# Altium project Pinto.PrjPcb
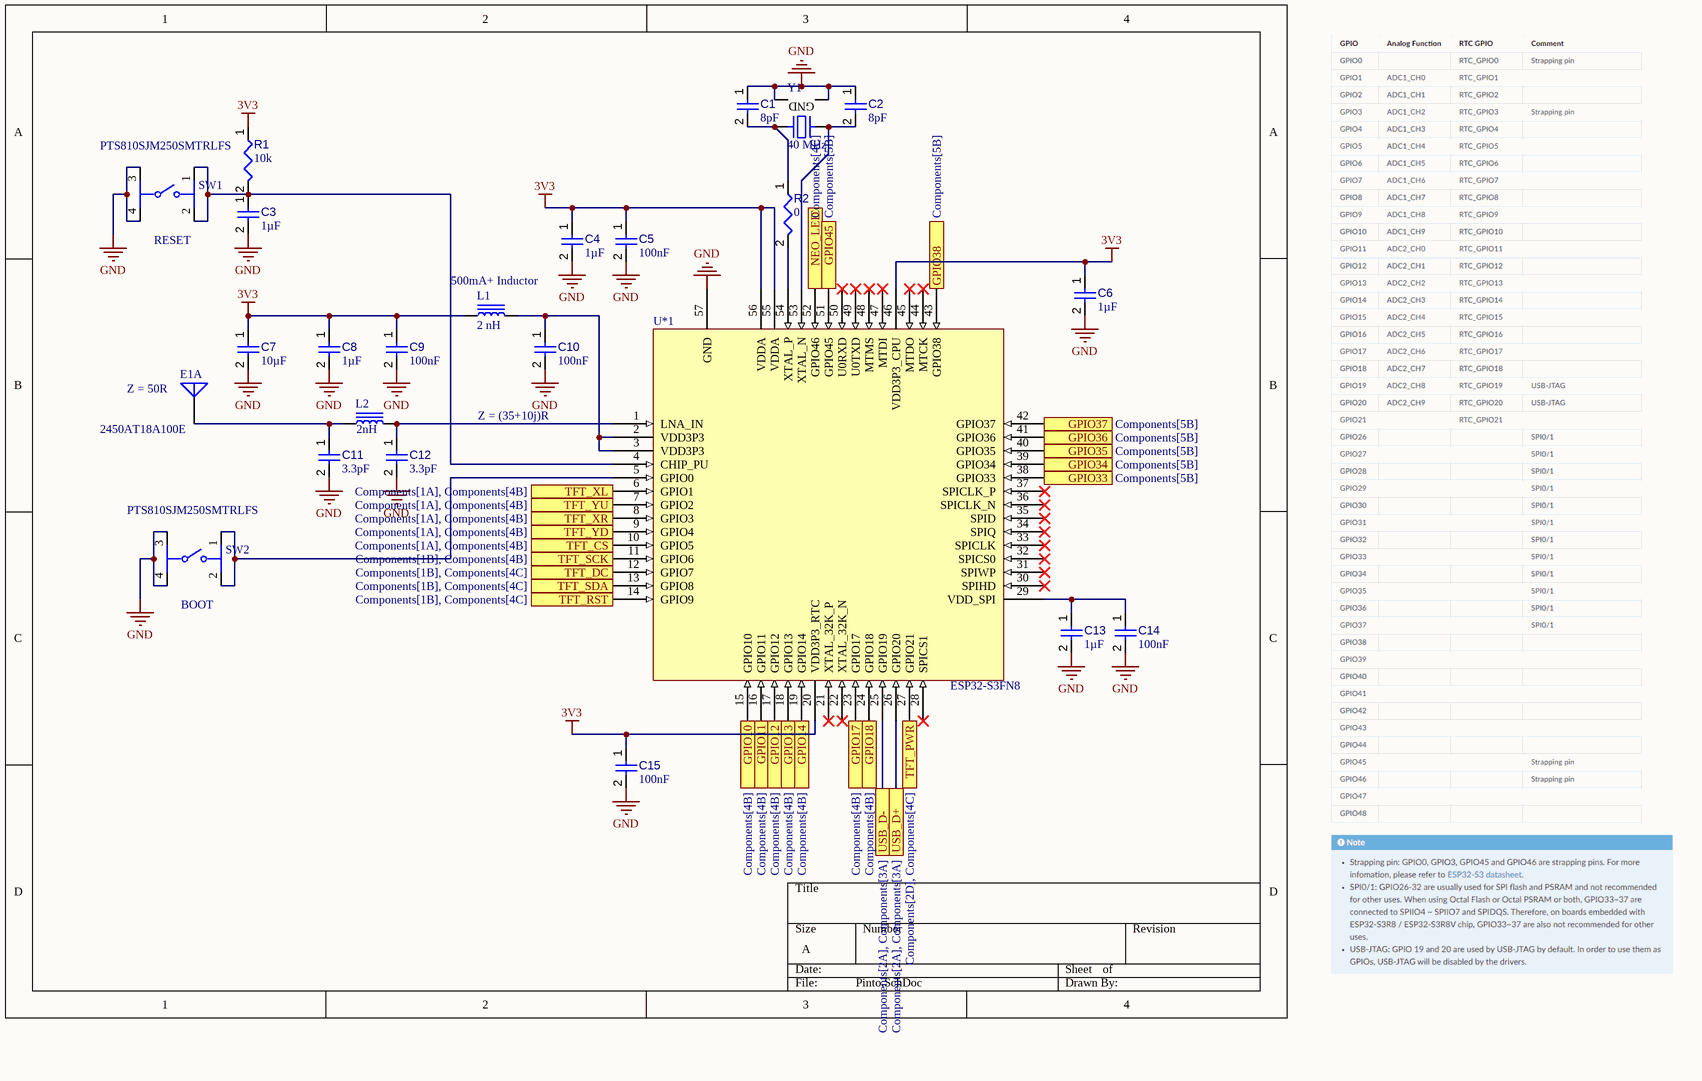
[diagram p0: Pinto.SchDoc]
2 sheets, 41 parts. Net scope: flat (ports and power ports of the same name join across sheets).
Board file: PCB.PcbDoc
Sheets:
  Pinto.SchDoc
  Components.SchDoc

## Sheet Pinto.SchDoc
size A; SheetNumber: 1; SheetTotal: 2

### Parts
C1  value 8pF  [CAPC0402(1005)33_L]  (hidden comment: Capacitor 12pF +/-10% 50V 0402)
C2  value 8pF  [CAPC0402(1005)33_L]  (hidden comment: Capacitor 12pF +/-10% 50V 0402)
C3  value 1µF  [CAPC0402(1005)60_L]  (hidden comment: Capacitor 1µF +/-20% 10V 0402)
C4  value 1µF  [CAPC0402(1005)60_L]  (hidden comment: Capacitor 1µF +/-20% 10V 0402)
C5  value 100nF  [CAPC0402(1005)60_L]  (hidden comment: Capacitor 100nF +/-20% 10V 0402)
C6  value 1µF  [CAPC0402(1005)60_L]  (hidden comment: Capacitor 1µF +/-20% 10V 0402)
C7  value 10µF  [CAPC0402(1005)60_L]  (hidden comment: Capacitor 10µF +/-40% 6.3V 0402)
C8  value 1µF  [CAPC0402(1005)60_L]  (hidden comment: Capacitor 1µF +/-20% 10V 0402)
C9  value 100nF  [CAPC0402(1005)60_L]  (hidden comment: Capacitor 100nF +/-20% 10V 0402)
C10  value 100nF  [CAPC0402(1005)60_L]  (hidden comment: Capacitor 100nF +/-20% 10V 0402)
C11  value 3.3pF  [CAPC1005X56X25LL10T15]  (hidden comment: Capacitor 0.1 uF +/- 5% 16 V 0402)
C12  value 3.3pF  [CAPC1005X56X25LL10T15]  (hidden comment: Capacitor 0.1 uF +/- 5% 16 V 0402)
C13  value 1µF  [CAPC0402(1005)60_L]  (hidden comment: Capacitor 1µF +/-20% 10V 0402)
C14  value 100nF  [CAPC0402(1005)60_L]  (hidden comment: Capacitor 100nF +/-20% 10V 0402)
C15  value 100nF  [CAPC0402(1005)60_L]  (hidden comment: Capacitor 100nF +/-20% 10V 0402)
E1  2450AT18A100E  [JT-2450AT18A100-2_V]  (part A of 2)
L1  2 nH  [IND 0201_0603]
L2  2nH  [IND 0201_0603]
R1  value 10k  [RESC0402(1005)_L]  (hidden comment: 10KR2F)
R2  value 0  [RESC0402(1005)_L]  (hidden comment: 0R2J)
SW1  PTS810SJM250SMTRLFS  [FP-PTS810SJM250SMTRLFS-MFG]
SW2  PTS810SJM250SMTRLFS  [FP-PTS810SJM250SMTRLFS-MFG]
U*1  ESP32-S3FN8  [PCBComponent_1]
Y1  40 MHz  [NDK NX3225SA]

### Ports
GPIO10 (see Components[4B]), GPIO11 (see Components[4B]), GPIO12 (see Components[4B]), GPIO13 (see Components[4B]), GPIO14 (see Components[4B]), GPIO17 (see Components[4B]), GPIO18 (see Components[4B]), GPIO33 (see Components[5B]), GPIO34 (see Components[5B]), GPIO35 (see Components[5B]), GPIO36 (see Components[5B]), GPIO37 (see Components[5B]), GPIO38 (see Components[5B]), GPIO45 (see Components[5B]), NEO_LED (see Components[4C]), TFT_CS (see Components[1A], Components[4B]), TFT_DC (see Components[1B], Components[4C]), TFT_PWR (see Components[2D], Components[4C]), TFT_RST (see Components[1B], Components[4C]), TFT_SCK (see Components[1B], Components[4B]), TFT_SDA (see Components[1B], Components[4C]), TFT_XL (see Components[1A], Components[4B]), TFT_XR (see Components[1A], Components[4B]), TFT_YD (see Components[1A], Components[4B]), TFT_YU (see Components[1A], Components[4B]), USB_D+ (see Components[2A], Components[3A]), USB_D- (see Components[2A], Components[3A])

### Nets
3V3: C4.1 C5.1 C6.1 C7.1 C8.1 C9.1 C15.1 L1.1 R1.1 U*1.20(VDD3P3_RTC) U*1.46(VDD3P3_CPU) U*1.55(VDDA) U*1.56(VDDA)
GND: C1.1 C2.1 C3.2 C4.2 C5.2 C6.2 C7.2 C8.2 C9.2 C10.2 C11.2 C12.2 C13.2 C14.2 C15.2 SW1.3 SW1.4 SW2.3 SW2.4 U*1.57(GND) Y1.2(GND) Y1.4(GND)
NetC1_2: C1.2 R2.1 Y1.3
NetC2_2: C2.2 U*1.53(XTAL_N) Y1.1
NetC3_1: C3.1 R1.2 SW1.1 SW1.2 U*1.4(CHIP_PU)
NetC10_1: C10.1 L1.2 U*1.2(VDD3P3) U*1.3(VDD3P3)
NetC11_1: C11.1 E1.1(FP) L2.1
NetC12_1: C12.1 L2.2 U*1.1(LNA_IN)
NetC13_1: C13.1 C14.1 U*1.29(VDD_SPI)
NetJ1_1: U*1.6(GPIO1) ; port TFT_XL
NetJ1_2: U*1.7(GPIO2) ; port TFT_YU
NetJ1_3: U*1.8(GPIO3) ; port TFT_XR
NetJ1_4: U*1.9(GPIO4) ; port TFT_YD
NetJ1_9: U*1.10(GPIO5) ; port TFT_CS
NetJ1_10: U*1.11(GPIO6) ; port TFT_SCK
NetJ1_11: U*1.12(GPIO7) ; port TFT_DC
NetJ1_13: U*1.13(GPIO8) ; port TFT_SDA
NetJ1_15: U*1.14(GPIO9) ; port TFT_RST
NetJ2_A6: U*1.26(GPIO20) ; port USB_D+
NetJ2_A7: U*1.25(GPIO19) ; port USB_D-
NetP1_3: U*1.15(GPIO10) ; port GPIO10
NetP1_4: U*1.16(GPIO11) ; port GPIO11
NetP1_5: U*1.17(GPIO12) ; port GPIO12
NetP1_6: U*1.18(GPIO13) ; port GPIO13
NetP1_7: U*1.19(GPIO14) ; port GPIO14
NetP1_8: U*1.23(GPIO17) ; port GPIO17
NetP1_9: U*1.24(GPIO18) ; port GPIO18
NetP2_3: U*1.51(GPIO45) ; port GPIO45
NetP2_4: U*1.43(GPIO38) ; port GPIO38
NetP2_5: U*1.42(GPIO37) ; port GPIO37
NetP2_6: U*1.41(GPIO36) ; port GPIO36
NetP2_7: U*1.40(GPIO35) ; port GPIO35
NetP2_8: U*1.39(GPIO34) ; port GPIO34
NetP2_9: U*1.38(GPIO33) ; port GPIO33
NetP3_10: U*1.27(GPIO21) ; port TFT_PWR
NetR2_2: R2.2 U*1.54(XTAL_P)
NetSW2_1: SW2.1 SW2.2 U*1.5(GPIO0)
NetU2_4: U*1.52(GPIO46) ; port NEO_LED

Not connected (* = marked no-connect by the designer): U*1 21(XTAL_32K_P)* 22(XTAL_32K_N)* 28(SPICS1)* 30(SPIHD)* 31(SPIWP)* 32(SPICS0)* 33(SPICLK)* 34(SPIQ)* 35(SPID)* 36(SPICLK_N)* 37(SPICLK_P)* 44(MTCK)* 45(MTDO)* 47(MTDI)* 48(MTMS)* 49(U0TXD)* 50(U0RXD)*

### Notes on the sheet
- (near SW1) RESET
- 500mA+ Inductor
- (near E1) Z = 50R
- Z = (35+10j)R
- (near SW2) BOOT

### Library data of the parts
C1 C2 = CMP-001-00072-4: Chip Capacitor, 12pF +/-10%, 50V, 0402, Thickness 0.33 mm; Tolerance: 20%; Pins: 2; Max Operating Temperature: 85°C; Case/Package: 0402; Voltage Rating: 50V; Mounting Technology: SMT; Min Operating Temperature: -55°C
C3 C4 C6 C8 C13 = CMP-001-00063-3: Chip Capacitor, 1µF +/-20%, 10V, 0402, Thickness 0.6 mm; Tolerance: 10%; Mounting Technology: SMT; Max Operating Temperature: 85°C; Voltage Rating: 10V; Pins: 2; Case/Package: 0402; Min Operating Temperature: -55°C
C5 C9 C10 C14 C15 = CMP-001-00061-3: Chip Capacitor, 100nF +/-20%, 10V, 0402, Thickness 0.6 mm; Tolerance: 20%; Mounting Technology: SMT; Voltage Rating: 10V; Max Operating Temperature: 85°C; Pins: 2; Case/Package: 0402; Min Operating Temperature: -55°C
C7 = CMP-001-00074-3: Chip Capacitor, 10µF +/-40%, 6.3V, 0402, Thickness 0.6 mm; Tolerance: 10%; Case/Package: 0402; Pins: 2; Mounting Technology: SMT; Voltage Rating: 6.3V; Max Operating Temperature: 85°C; Min Operating Temperature: -55°C
C11 C12 = CMP-001-00001-6: Chip Capacitor, 0.1 uF, +/- 5%, 16 V, 0402 (1005 Metric); Capacitor Type: Ceramic; Voltage Rating: 16V; Max Operating Temperature: 125°C; Min Operating Temperature: -55°C; Case/Package: 0402; Mounting Technology: SM; Pins: 2; Tolerance: 5%; RoHS Compliant: True
E1 = CMP-2000-05167-1: Ceramic Antenna, 2.45 GHZ, 2 W, -40 to 125 degC, 2-Pin SMD, RoHS, Tape and Reel; Manufacturer: Johanson Technology; Maximum Frequency: 2500MHz; Typical Antenna Gain: 0.5dB; Minimum Frequency: 2400MHz; Manufacturer URL: https://www.johansontechnology.com/; Type: Ceramic; Datasheet Version: Rev. 1.3, 07/2014; Category: Antenna; Package: 2Case18-4; Datasheet URL: http://www.johansontechnology.com/datasheets/antennas/2450AT18A100.pdf
L1 L2 = WLCM0603TGB2N0TB: INDUCTOR FIXED 2.0NH 0201; Manufacturer: Walsin Technology Corporation; Current Rating (Amps): 450 mA; DC Resistance (DCR): 200mOhm Max; Frequency - Self Resonant: 12.5GHz; Inductance Frequency - Test: 500 MHz; Material - Core: Ceramic; Q @ Freq: 12 @ 500MHz; Shielding: Unshielded; Tolerance: ±0.1nH; Type: Multilayer; Part Number: WLCM0603TGB2N0TB; ComponentLink1Description: Datasheet; ComponentLink1URL: https://www.passivecomponent.com/wp-content/uploads/inductor/WLCM0603TG_Series.pdf; ComponentLink2Description: DigiKey Link; ComponentLink2URL: https://www.digikey.com/en/products/detail/walsin-technology-corporation/WLCM0603TGB2N0TB/14563834; Device Package: 0201 (0603 Metric); Height - Seated (Max): 0.013" (0.33mm); Inductance: 2 nH; LastUpdated: 1/2/2023 9:01:21 PM; Lifecycle Status: Active; Minimum Order: 1; Mounting Type: Surface Mount; Operating Temperature: -55°C ~ 125°C; Package / Case: 0201 (0603 Metric); Packaging: CutTape; PartId: 3830; Part Status: Active; Price: 0.01; Series: CM; Size / Dimension: 0.024" L x 0.012" W (0.60mm x 0.30mm); Supplier 1: DigiKey; Supplier Part Number 1: 1292-WLCM0603TGB2N0TBCT-ND; Supplier Device Package: 0201; Value: 2 nH
R1 = CMP-009-00066-2: 10K 0.063W 1% 0402 (1005 Metric)  SMD; Power: 63mW; Case/Package: 0402; Mounting Technology: SMT; Pins: 2; Tolerance: 1%
R2 = CMP-009-00062-2: Jumper 0402 (1005 Metric); Pins: 2; Mounting Technology: SMT; Case/Package: 0402
SW1 SW2 = CMP-10040-000001-2: SWITCH TACTILE SPST-NO 0.05A 16V; Throw Configuration: SPST; Operating Force: 160gf; Actuator Type: Standard; Switch Travel: 0.15mm; Switch Function: Off-Mom; Max Current Rating: 50mA; Mechanical Life: 150000Cycles; Illumination Type: Non-Illuminated; Package Quantity: 2900; Depth: 4.6mm; Mount: Surface Mount; Packaging: Tape and Reel; Length: 3.2mm; RoHS Compliant: Yes; Case/Package: SMD/SMT; Voltage Rating (DC): 16V; Min Operating Temperature: -40°C; Termination: J-Bend; Lead Free: Lead Free; Contact Plating: Silver; Orientation: Straight; Max Operating Temperature: 85°C; Current Rating: 50mA; Color: Black
U*1 = ESP32-S3FN8: ESP32 MCU
Y1 = NX3225SA-40M-EXS00A-CS03880: CRYSTAL 40.0000MHZ 10PF SMD; Manufacturer: NDK America, Inc.; ESR (Equivalent Series Resistance): 50 Ohms; Frequency Stability: ±17ppm; Frequency Tolerance: ±10ppm; Operating Mode: Fundamental; Part Number: NX3225SA-40M-EXS00A-CS03880; ComponentLink1Description: Datasheet; ComponentLink1URL: //media.digikey.com/pdf/Data%20Sheets/NDK%20PDFs/NX3225SA-40M-EXS00A-CS03880.pdf; ComponentLink2Description: DigiKey Link; ComponentLink2URL: https://www.digikey.com/en/products/detail/ndk-america-inc/NX3225SA-40M-EXS00A-CS03880/5015625; Frequency: 40 MHz; Height - Seated (Max): 0.024" (0.60mm); LastUpdated: 1/2/2023 8:58:25 PM; Lifecycle Status: Active; Load Capacitance: 10pF; Minimum Order: 1; Mounting Type: Surface Mount; Operating Temperature: -40°C ~ 85°C; Package / Case: 4-SMD, No Lead; Packaging: TapeAndReel; PartId: 586; Part Status: Active; Price: 0.36; Series: NX3225SA; Size / Dimension: 0.126" L x 0.098" W (3.20mm x 2.50mm); Supplier 1: DigiKey; Supplier Part Number 1: 644-1249-1-ND; Type: MHz Crystal; Value: 40 MHz

## Sheet Components.SchDoc
size B; SheetNumber: 2; SheetTotal: 2
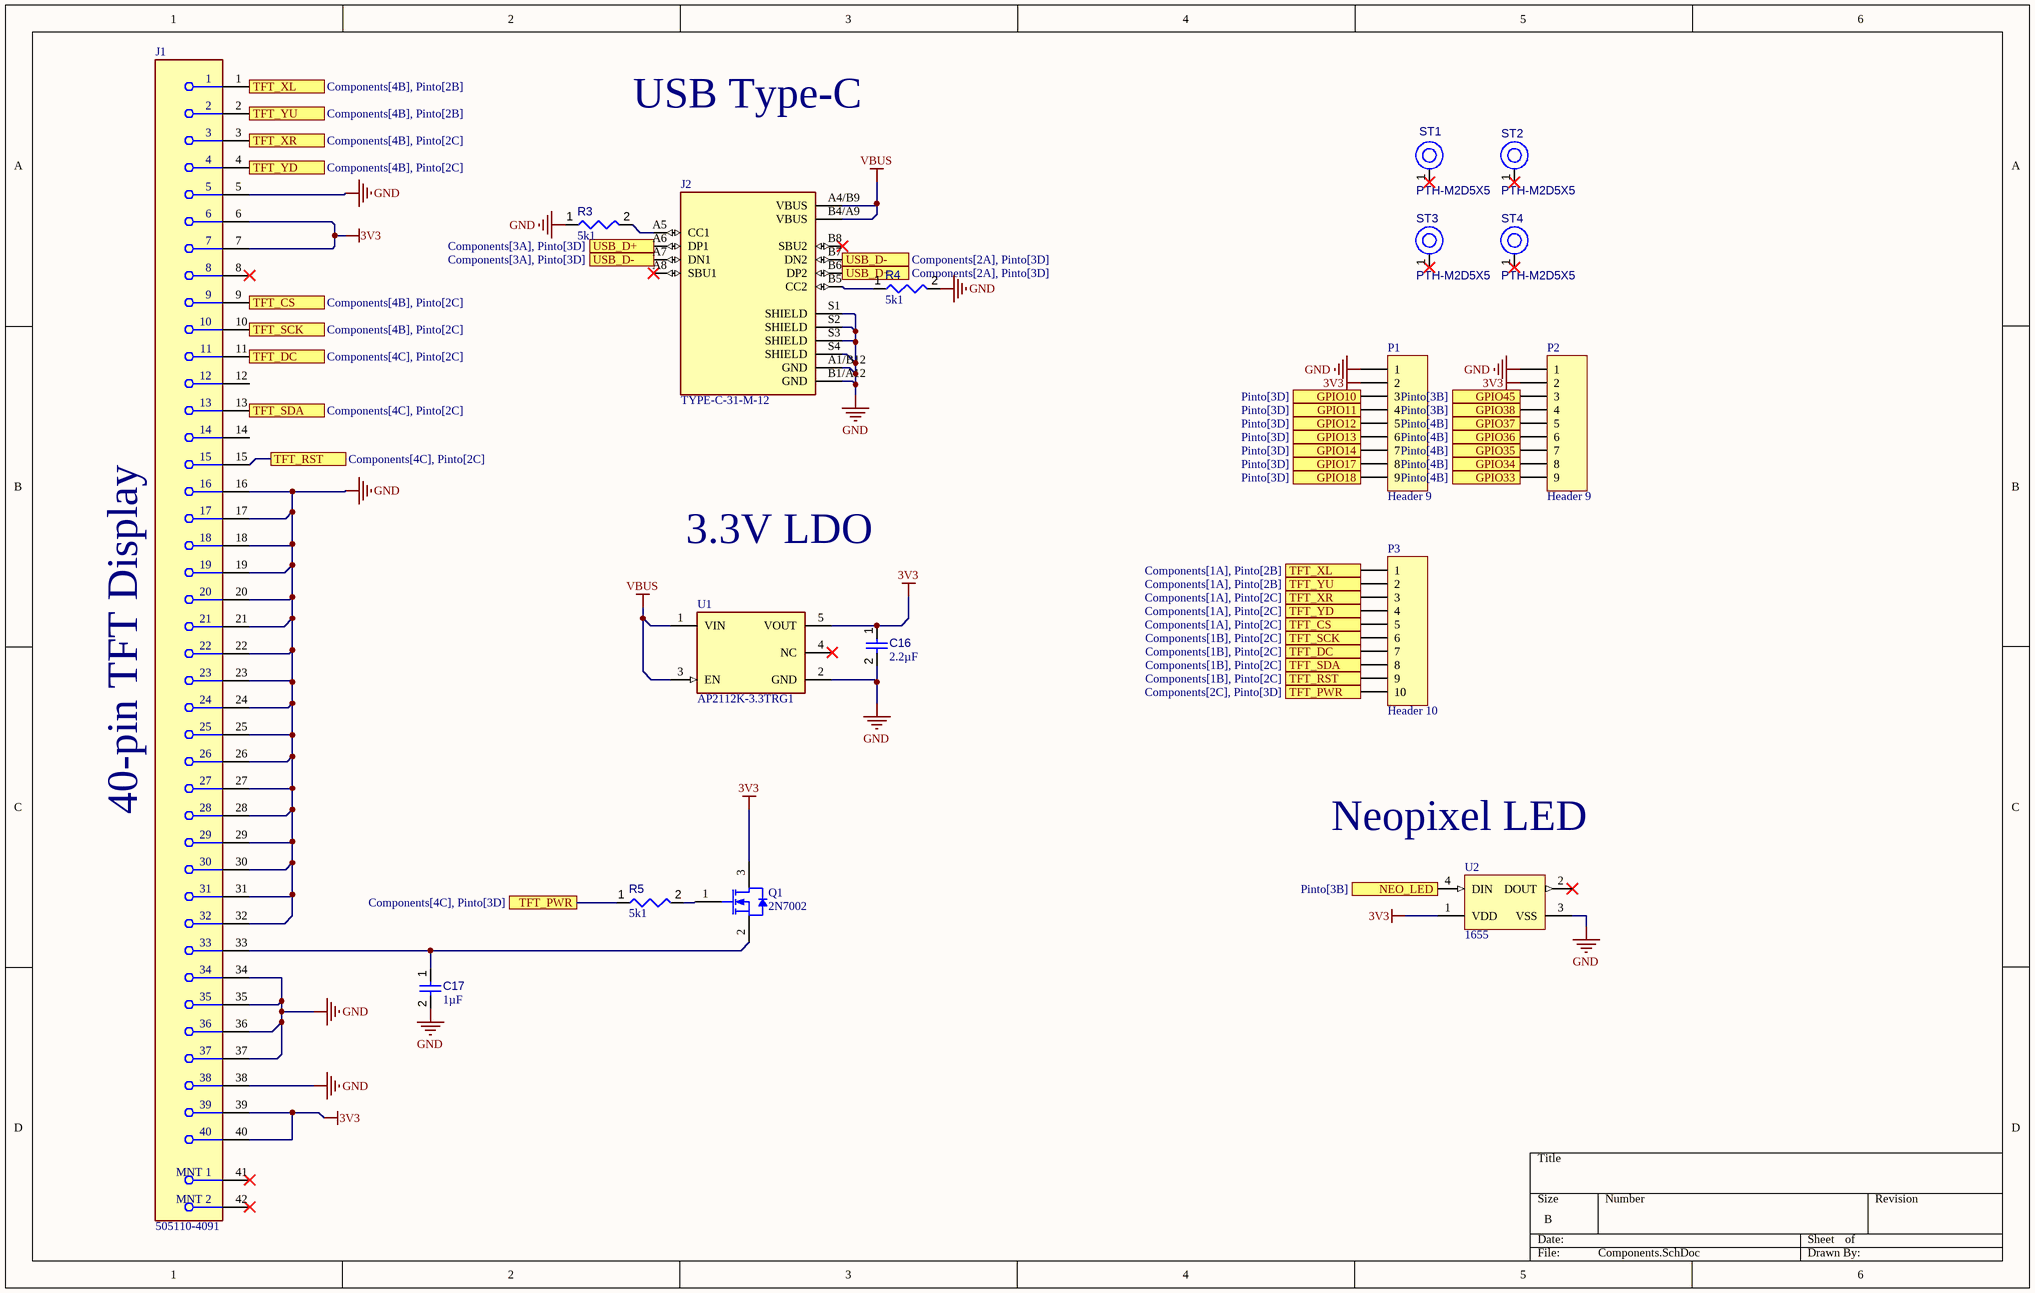
[diagram p1: Components.SchDoc]

### Parts
C16  value 2.2µF  [CAPC0402(1005)60_L]  (hidden comment: Capacitor 2,2µF +/-20% 10V 0402)
C17  value 1µF  [CAPC0402(1005)60_L]  (hidden comment: Capacitor 1µF +/-20% 10V 0402)
J1  505110-4091  [FP-505110-4091-MFG]
J2  TYPE-C-31-M-12  [HRO_TYPE-C-31-M-12]
P1  Header 9  [HDR1X9]
P2  Header 9  [HDR1X9]
P3  Header 10  [HDR1X10]
Q1  2N7002  [STM-SOT-23-3_V]
R3  value 5k1  [RESC0402(1005)_L]  (hidden comment: 0R2J)
R4  value 5k1  [RESC0402(1005)_L]  (hidden comment: 0R2J)
R5  value 5k1  [RESC0402(1005)_L]  (hidden comment: 0R2J)
ST1  PTH-M2D5X5  [PTH-M2D5X5]
ST2  PTH-M2D5X5  [PTH-M2D5X5]
ST3  PTH-M2D5X5  [PTH-M2D5X5]
ST4  PTH-M2D5X5  [PTH-M2D5X5]
U1  AP2112K-3.3TRG1  [FP-SOT25-IPC_A]
U2  1655  [ADA-RGB-1655_V]

### Ports
GPIO10 (see Pinto[3D]), GPIO11 (see Pinto[3D]), GPIO12 (see Pinto[3D]), GPIO13 (see Pinto[3D]), GPIO14 (see Pinto[3D]), GPIO17 (see Pinto[3D]), GPIO18 (see Pinto[3D]), GPIO33 (see Pinto[4B]), GPIO34 (see Pinto[4B]), GPIO35 (see Pinto[4B]), GPIO36 (see Pinto[4B]), GPIO37 (see Pinto[4B]), GPIO38 (see Pinto[3B]), GPIO45 (see Pinto[3B]), NEO_LED (see Pinto[3B]), TFT_CS (see Components[1A], Pinto[2C]), TFT_CS (see Components[4B], Pinto[2C]), TFT_DC (see Components[1B], Pinto[2C]), TFT_DC (see Components[4C], Pinto[2C]), TFT_PWR (see Components[2C], Pinto[3D]), TFT_PWR (see Components[4C], Pinto[3D]), TFT_RST (see Components[1B], Pinto[2C]), TFT_RST (see Components[4C], Pinto[2C]), TFT_SCK (see Components[1B], Pinto[2C]), TFT_SCK (see Components[4B], Pinto[2C]), TFT_SDA (see Components[1B], Pinto[2C]), TFT_SDA (see Components[4C], Pinto[2C]), TFT_XL (see Components[1A], Pinto[2B]), TFT_XL (see Components[4B], Pinto[2B]), TFT_XR (see Components[1A], Pinto[2C]), TFT_XR (see Components[4B], Pinto[2C]), TFT_YD (see Components[1A], Pinto[2C]), TFT_YD (see Components[4B], Pinto[2C]), TFT_YU (see Components[1A], Pinto[2B]), TFT_YU (see Components[4B], Pinto[2B]), USB_D+ (see Components[2A], Pinto[3D]), USB_D+ (see Components[3A], Pinto[3D]), USB_D- (see Components[2A], Pinto[3D]), USB_D- (see Components[3A], Pinto[3D])

### Nets
3V3: C16.1 J1.6 J1.7 J1.39 J1.40 P1.2 P2.2 Q1.3(D) U1.5(VOUT) U2.1(VDD)
GND: C16.2 C17.2 J1.5 J1.16 J1.17 J1.18 J1.19 J1.20 J1.21 J1.22 J1.23 J1.24 J1.25 J1.26 J1.27 J1.28 J1.29 J1.30 J1.31 J1.32 J1.34 J1.35 J1.36 J1.37 J1.38 J2.A1/B12(GND) J2.B1/A12(GND) J2.S1(SHIELD) J2.S2(SHIELD) J2.S3(SHIELD) J2.S4(SHIELD) P1.1 P2.1 R3.1 R4.2 U1.2(GND) U2.3(VSS)
VBUS: J2.A4/B9(VBUS) J2.B4/A9(VBUS) U1.1(VIN) U1.3(EN)
NetC17_1: C17.1 J1.33 Q1.2(S)
NetJ1_1: J1.1 P3.1 ; port TFT_XL
NetJ1_2: J1.2 P3.2 ; port TFT_YU
NetJ1_3: J1.3 P3.3 ; port TFT_XR
NetJ1_4: J1.4 P3.4 ; port TFT_YD
NetJ1_9: J1.9 P3.5 ; port TFT_CS
NetJ1_10: J1.10 P3.6 ; port TFT_SCK
NetJ1_11: J1.11 P3.7 ; port TFT_DC
NetJ1_13: J1.13 P3.8 ; port TFT_SDA
NetJ1_15: J1.15 P3.9 ; port TFT_RST
NetJ2_A5: J2.A5(CC1) R3.2
NetJ2_A6: J2.A6(DP1) J2.B6(DP2) ; port USB_D+
NetJ2_A7: J2.A7(DN1) J2.B7(DN2) ; port USB_D-
NetJ2_B5: J2.B5(CC2) R4.1
NetP1_3: P1.3 ; port GPIO10
NetP1_4: P1.4 ; port GPIO11
NetP1_5: P1.5 ; port GPIO12
NetP1_6: P1.6 ; port GPIO13
NetP1_7: P1.7 ; port GPIO14
NetP1_8: P1.8 ; port GPIO17
NetP1_9: P1.9 ; port GPIO18
NetP2_3: P2.3 ; port GPIO45
NetP2_4: P2.4 ; port GPIO38
NetP2_5: P2.5 ; port GPIO37
NetP2_6: P2.6 ; port GPIO36
NetP2_7: P2.7 ; port GPIO35
NetP2_8: P2.8 ; port GPIO34
NetP2_9: P2.9 ; port GPIO33
NetP3_10: P3.10 R5.1 ; port TFT_PWR
NetQ1_1: Q1.1(G) R5.2
NetU2_4: U2.4(DIN) ; port NEO_LED

Not connected (* = marked no-connect by the designer): J1 8* 12 14 41(MNT_1)* 42(MNT_2)*; J2 A8(SBU1)* B8(SBU2)*; ST1 1(H1)*; ST2 1(H1)*; ST3 1(H1)*; ST4 1(H1)*; U1 4(NC)*; U2 2(DOUT)*

### Notes on the sheet
- USB Type-C
- 3.3V LDO
- 40-pin TFT Display
- (near U2) Neopixel LED

### Library data of the parts
C16 = CMP-001-00056-4: Chip Capacitor, 2,2µF +/-20%, 10V, 0402, Thickness 0.6 mm; Tolerance: 10%; Mounting Technology: SMT; Max Operating Temperature: 85°C; Case/Package: 0402; Pins: 2; Min Operating Temperature: -55°C; Voltage Rating: 10V
C17 = CMP-001-00063-3: as C3 on sheet Pinto; Mounting Technology: SMT; Max Operating Temperature: 85°C; Voltage Rating: 10V; Pins: 2; Case/Package: 0402; Min Operating Temperature: -55°C
J1 = CMP-04775-000011-1: CONN FFC/FPC BOTTOM 40P .5MM R/A; Actuator Material: Nylon; Mating Cycles: 25; Actuator Color: Black; Voltage Rating: 50V; Number of Circuits: 40; Current Rating: 500mA; Pitch: 0.5mm; Gender: Receptacle; Contact Plating: Gold; Number of Rows: 1; Number of Pins: 40; Termination: Solder; Packaging: Cut Tape; Max Operating Temperature: 105°C; Housing Color: Beige; Mount: Surface Mount; Halogen Free: Low Halogen; Flammability Rating: UL94 V-0; Series: Easy-On 505110; Min Operating Temperature: -40°C; Contact Material: Bronze; Housing Material: Polymer; Height: 1.9mm; Number of Contacts: 40; Number of Positions: 40; Orientation: Right Angle
J2 = CMP-005-000001-1: USB Connectors 24 Receptacle 1 8.94*7.3mm RoHS; MF: HRO Electronics Co., Ltd.; Source: TYPE-C-31-M-12.SchLib; SnapEDA_Link: https://www.snapeda.com/parts/TYPE-C-31-M-12/HRO+Electronics+Co.%252C+Ltd./view-part/?ref=snap; MP: TYPE-C-31-M-12; Design Item ID: TYPE-C-31-M-12; Value: *; Component Type: Standard; Price: None; Package: Package; Check_prices: https://www.snapeda.com/parts/TYPE-C-31-M-12/HRO+Electronics+Co.%252C+Ltd./view-part/?ref=eda; Availability: Not in stock; Pin Count: 16
P1 P2 = Header 9: Header, 9-Pin; LatestRevisionDate: 17-Jul-2002; LatestRevisionNote: Re-released for DXP Platform.; Publisher: Altium Limited
P3 = Header 10: Header, 10-Pin; LatestRevisionDate: 17-Jul-2002; LatestRevisionNote: Re-released for DXP Platform.; Publisher: Altium Limited
Q1 = CMP-0434-00001-1: N-channel 60 V, 1.8 Ohm, 0.35 A STripFET(TM) II Power MOSFET, SOT23; Manufacturer: STMicroelectronics; PartNumber: 2N7002; ComponentLink2Description: Datasheet; ComponentLink2URL: http://www.st.com/st-web-ui/static/active/en/resource/technical/document/datasheet/CD00005134.pdf; ComponentLink1Description: Manufacturer URL; ComponentLink1URL: http://www.st.com/; DatasheetVersion: Rev. 9, 11/2008; PackageReference: SOT-23; Mounting Technology: Surface Mount; PackageDescription: 3-Pin SOT23, 3.016 x 2.8 mm Body, 0.95 mm Pitch
R3-R5 = CMP-009-00062-2: Jumper 0402 (1005 Metric); Pins: 2; Mounting Technology: SMT; Case/Package: 0402
ST1-ST4 = CMP-00028-00004-2: M2 PTH (2.5mm), 5mm pad; Pins: 1
U1 = CMP-12756-000035-1: IC REG LINEAR 3.3V 600MA SOT25; Number of Regulators: 1; Output Type: Fixed; Polarity: Positive; Min Input Voltage: 2.5V; Max Input Voltage: 6V; Accuracy: 1.5%; Quiescent Current: 55uA; Dropout Voltage: 250mV; Min Operating Temperature: -40°C; Length: 3.1mm; Output Current: 600mA; Max Operating Temperature: 85°C; Package Quantity: 1; Output Voltage: 3.3V; Width: 1.7mm; Number of Outputs: 1; Packaging: Tape and Reel; Height: 1.3mm; Lead Free: Lead Free; Max Output Current: 600mA; Case/Package: SOT-23-5; Mount: Surface Mount; Number of Pins: 5
U2 = CMP-2000-05026-1: Intelligent Control LED Integrated Light Source, 3.5 to 5.3 V, -25 to 80 degC, 4-Pin SMD, RoHS, Tape and Reel; Manufacturer: Adafruit-Industries-LLC; Number of LEDs: 10; Configuration: Discrete; Utilized LED: WS2812(5050); Datasheet URL: http://datasheet.octopart.com/ADA1655-Adafruit-Industries-datasheet-32028139.pdf; Series: Neopixel; Interface: -; Package Description: 4-Pin Surface Mount Device, Body 5 x 5 mm; Color: Red,Green,Blue(RGB); Category: Optoelectronics; Controller Type: -; Package Reference: 1655; Manufacturer URL: https://www.adafruit.com/; Mounting Type: SurfaceMount; Datasheet Version: May-13; Size / Dimension: 5.00mmLx5.00mmW; Family: Addressable,Specialty

## Nets that join several sheets
3V3: Pinto (13 pins), Components (10 pins)
GND: Pinto (22 pins), Components (37 pins)
NetJ1_1: Pinto (U*1.6), Components (J1.1 P3.1)
NetJ1_2: Pinto (U*1.7), Components (J1.2 P3.2)
NetJ1_3: Pinto (U*1.8), Components (J1.3 P3.3)
NetJ1_4: Pinto (U*1.9), Components (J1.4 P3.4)
NetJ1_9: Pinto (U*1.10), Components (J1.9 P3.5)
NetJ1_10: Pinto (U*1.11), Components (J1.10 P3.6)
NetJ1_11: Pinto (U*1.12), Components (J1.11 P3.7)
NetJ1_13: Pinto (U*1.13), Components (J1.13 P3.8)
NetJ1_15: Pinto (U*1.14), Components (J1.15 P3.9)
NetJ2_A6: Pinto (U*1.26), Components (J2.A6 J2.B6)
NetJ2_A7: Pinto (U*1.25), Components (J2.A7 J2.B7)
NetP1_3: Pinto (U*1.15), Components (P1.3)
NetP1_4: Pinto (U*1.16), Components (P1.4)
NetP1_5: Pinto (U*1.17), Components (P1.5)
NetP1_6: Pinto (U*1.18), Components (P1.6)
NetP1_7: Pinto (U*1.19), Components (P1.7)
NetP1_8: Pinto (U*1.23), Components (P1.8)
NetP1_9: Pinto (U*1.24), Components (P1.9)
NetP2_3: Pinto (U*1.51), Components (P2.3)
NetP2_4: Pinto (U*1.43), Components (P2.4)
NetP2_5: Pinto (U*1.42), Components (P2.5)
NetP2_6: Pinto (U*1.41), Components (P2.6)
NetP2_7: Pinto (U*1.40), Components (P2.7)
NetP2_8: Pinto (U*1.39), Components (P2.8)
NetP2_9: Pinto (U*1.38), Components (P2.9)
NetP3_10: Pinto (U*1.27), Components (P3.10 R5.1)
NetU2_4: Pinto (U*1.52), Components (U2.4)